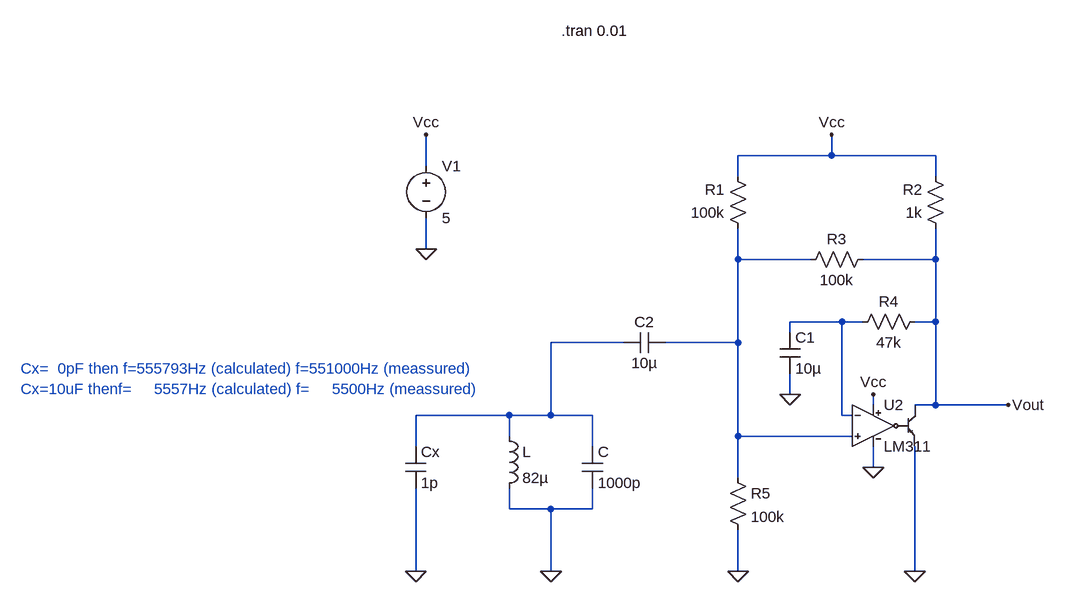
[diagram p0: schematic VK3BHR_schematics.asc]
VK3BHR_schematics.asc, the LTspice schematic file:
Version 4
SHEET 1 880 680
WIRE 192 -48 192 -80
WIRE 192 -48 48 -48
WIRE 352 -48 192 -48
WIRE -432 -32 -432 -80
WIRE 48 -16 48 -48
WIRE 352 -16 352 -48
WIRE -432 96 -432 48
WIRE 48 112 48 64
WIRE 160 112 48 112
WIRE 352 112 352 64
WIRE 352 112 240 112
WIRE 208 208 128 208
WIRE 240 208 208 208
WIRE 352 208 352 112
WIRE 352 208 320 208
WIRE 128 224 128 208
WIRE -128 240 -240 240
WIRE 48 240 48 112
WIRE 48 240 -64 240
WIRE 128 320 128 288
WIRE 256 336 256 320
WIRE 352 336 352 208
WIRE 352 336 320 336
WIRE 464 336 352 336
WIRE -304 352 -448 352
WIRE -240 352 -240 240
WIRE -240 352 -304 352
WIRE -176 352 -240 352
WIRE 208 352 208 208
WIRE 224 352 208 352
WIRE -304 384 -304 352
WIRE 48 384 48 240
WIRE 224 384 48 384
WIRE -448 400 -448 352
WIRE -176 400 -176 352
WIRE 256 432 256 400
WIRE 48 448 48 384
WIRE -304 496 -304 464
WIRE -240 496 -304 496
WIRE -176 496 -176 464
WIRE -176 496 -240 496
WIRE -448 592 -448 464
WIRE -240 592 -240 496
WIRE 48 592 48 528
WIRE 320 592 320 400
FLAG 320 592 0
FLAG -432 96 0
FLAG -432 -80 Vcc
FLAG 192 -80 Vcc
FLAG 256 320 Vcc
FLAG 256 432 0
FLAG 48 592 0
FLAG -240 592 0
FLAG 128 320 0
FLAG 464 336 Vout
FLAG -448 592 0
SYMBOL LM311 256 304 R0
SYMATTR InstName U2
SYMBOL res 64 80 R180
WINDOW 0 36 76 Left 2
WINDOW 3 36 40 Left 2
SYMATTR InstName R1
SYMATTR Value 100k
SYMBOL res 368 80 R180
WINDOW 0 36 76 Left 2
WINDOW 3 36 40 Left 2
SYMATTR InstName R2
SYMATTR Value 1k
SYMBOL res 256 96 R90
WINDOW 0 0 56 VBottom 2
WINDOW 3 32 56 VTop 2
SYMATTR InstName R3
SYMATTR Value 100k
SYMBOL voltage -432 -48 R0
WINDOW 123 0 0 Left 0
WINDOW 39 0 0 Left 0
SYMATTR InstName V1
SYMATTR Value 5
SYMBOL res 336 192 R90
WINDOW 0 0 56 VBottom 2
WINDOW 3 32 56 VTop 2
SYMATTR InstName R4
SYMATTR Value 47k
SYMBOL cap 112 224 R0
SYMATTR InstName C1
SYMATTR Value 10µ
SYMBOL res 32 432 R0
SYMATTR InstName R5
SYMATTR Value 100k
SYMBOL cap -64 224 R90
WINDOW 0 0 32 VBottom 2
WINDOW 3 32 32 VTop 2
SYMATTR InstName C2
SYMATTR Value 10µ
SYMBOL ind -320 368 R0
SYMATTR InstName L
SYMATTR Value 82µ
SYMBOL cap -192 400 R0
SYMATTR InstName C
SYMATTR Value 1000p
SYMBOL cap -464 400 R0
SYMATTR InstName Cx
SYMATTR Value 1p
TEXT -224 -240 Left 2 !.tran 0.01
TEXT -1056 280 Left 2 ;Cx=  0pF then f=555793Hz (calculated) f=551000Hz (meassured)\nCx=10uF thenf=     5557Hz (calculated) f=     5500Hz (meassured)

The netlist it stands for:
* VK3BHR_schematics.asc
XU2 N001 N002 Vcc 0 Vout 0 LM311  ; pins In+ In- V+ V- Collector Emitter
R1 N001 Vcc 100k
R2 Vout Vcc 1k
R3 Vout N001 100k
V1 Vcc 0 5
R4 Vout N002 47k
C1 N002 0 10µ
R5 N001 0 100k
C2 N001 N003 10µ
L N003 0 82µ
C N003 0 1000p
Cx N003 0 1p
.tran 0.01
* Cx=  0pF then f=555793Hz (calculated) f=551000Hz (meassured)
* Cx=10uF thenf=     5557Hz (calculated) f=     5500Hz (meassured)
.lib LM311.sub
.backanno
.end